# EAGLE schematic CTM_Status_Station_Design_v24 (EAGLE 9.7.0)
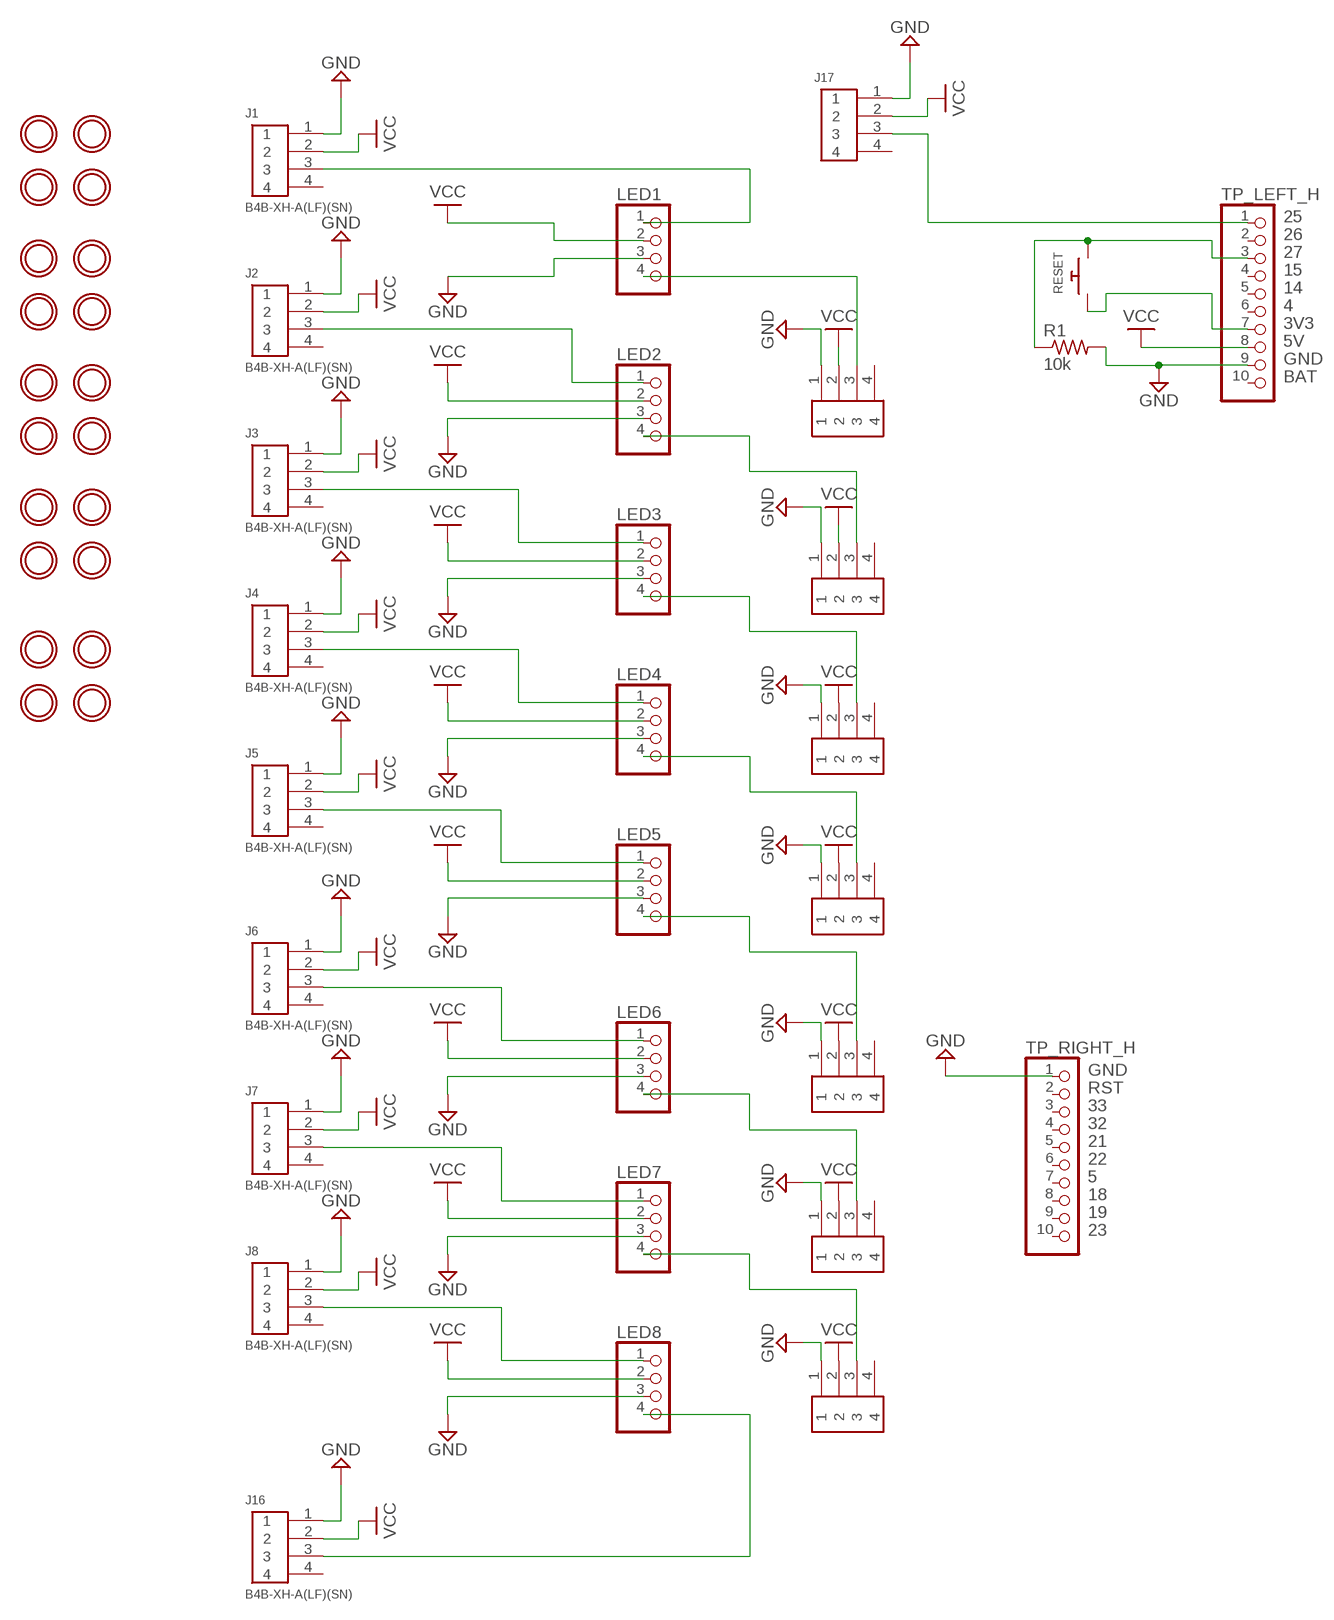
[diagram p0: schematic, sheet 1]

## Parts
J1  B4B-XH-A(LF)(SN)  [B4B-XH-A(LF)(SN)]
J2  B4B-XH-A(LF)(SN)  [B4B-XH-A(LF)(SN)]
J3  B4B-XH-A(LF)(SN)  [B4B-XH-A(LF)(SN)]
J4  B4B-XH-A(LF)(SN)  [B4B-XH-A(LF)(SN)]
J5  B4B-XH-A(LF)(SN)  [B4B-XH-A(LF)(SN)]
J6  B4B-XH-A(LF)(SN)  [B4B-XH-A(LF)(SN)]
J7  B4B-XH-A(LF)(SN)  [B4B-XH-A(LF)(SN)]
J8  B4B-XH-A(LF)(SN)  [B4B-XH-A(LF)(SN)]
J9  B4B-XH-A(LF)(SN)  [B4B-XH-A(LF)(SN)]
J10  B4B-XH-A(LF)(SN)  [B4B-XH-A(LF)(SN)]
J11  B4B-XH-A(LF)(SN)  [B4B-XH-A(LF)(SN)]
J12  B4B-XH-A(LF)(SN)  [B4B-XH-A(LF)(SN)]
J13  B4B-XH-A(LF)(SN)  [B4B-XH-A(LF)(SN)]
J14  B4B-XH-A(LF)(SN)  [B4B-XH-A(LF)(SN)]
J15  B4B-XH-A(LF)(SN)  [B4B-XH-A(LF)(SN)]
J16  B4B-XH-A(LF)(SN)  [B4B-XH-A(LF)(SN)]
J17  B4B-XH-A(LF)(SN)  [B4B-XH-A(LF)(SN)]
LED1  PINHD-1X4  [1X04]
LED2  PINHD-1X4  [1X04]
LED3  PINHD-1X4  [1X04]
LED4  PINHD-1X4  [1X04]
LED5  PINHD-1X4  [1X04]
LED6  PINHD-1X4  [1X04]
LED7  PINHD-1X4  [1X04]
LED8  PINHD-1X4  [1X04]
R1  10k  R-US_0207/7  [0207/7]
RESET  SWITCH_PUSHBUTTONEVQ-PE  [TACT_PANA-EVQ]
TP_LEFT_H  PINHD-1X10  [1X10]
TP_RIGHT_H  PINHD-1X10  [1X10]
U$1  MOUNTINGHOLE2.5  [MOUNTINGHOLE_2.5_PLATED]
U$2  MOUNTINGHOLE2.5  [MOUNTINGHOLE_2.5_PLATED]
U$3  MOUNTINGHOLE2.5  [MOUNTINGHOLE_2.5_PLATED]
U$4  MOUNTINGHOLE2.5  [MOUNTINGHOLE_2.5_PLATED]
U$5  MOUNTINGHOLE2.5  [MOUNTINGHOLE_2.5_PLATED]
U$6  MOUNTINGHOLE2.5  [MOUNTINGHOLE_2.5_PLATED]
U$7  MOUNTINGHOLE2.5  [MOUNTINGHOLE_2.5_PLATED]
U$8  MOUNTINGHOLE2.5  [MOUNTINGHOLE_2.5_PLATED]
U$9  MOUNTINGHOLE2.5  [MOUNTINGHOLE_2.5_PLATED]
U$10  MOUNTINGHOLE2.5  [MOUNTINGHOLE_2.5_PLATED]
U$11  MOUNTINGHOLE2.5  [MOUNTINGHOLE_2.5_PLATED]
U$12  MOUNTINGHOLE2.5  [MOUNTINGHOLE_2.5_PLATED]
U$13  MOUNTINGHOLE2.5  [MOUNTINGHOLE_2.5_PLATED]
U$14  MOUNTINGHOLE2.5  [MOUNTINGHOLE_2.5_PLATED]
U$15  MOUNTINGHOLE2.5  [MOUNTINGHOLE_2.5_PLATED]
U$16  MOUNTINGHOLE2.5  [MOUNTINGHOLE_2.5_PLATED]
U$17  MOUNTINGHOLE2.5  [MOUNTINGHOLE_2.5_PLATED]
U$18  MOUNTINGHOLE2.5  [MOUNTINGHOLE_2.5_PLATED]
U$19  MOUNTINGHOLE2.5  [MOUNTINGHOLE_2.5_PLATED]
U$28  MOUNTINGHOLE2.5  [MOUNTINGHOLE_2.5_PLATED]

## Nets
3V3: RESET.P$1 TP_LEFT_H.7
DIN1: J1.3 LED1.1
DIN2: J2.3 LED2.1
DIN3: J3.3 LED3.1
DIN4: J4.3 LED4.1
DIN5: J5.3 LED5.1
DIN6: J6.3 LED6.1
DIN7: J7.3 LED7.1
DIN8: J8.3 LED8.1
DOUT: J17.3 TP_LEFT_H.1
DOUT1: J10.3 LED1.4
DOUT2: J9.3 LED2.4
DOUT3: J11.3 LED3.4
DOUT4: J12.3 LED4.4
DOUT5: J13.3 LED5.4
DOUT6: J14.3 LED6.4
DOUT7: J15.3 LED7.4
DOUT8: J16.3 LED8.4
GND: J1.1 J2.1 J3.1 J4.1 J5.1 J6.1 J7.1 J8.1 J9.1 J10.1 J11.1 J12.1 J13.1 J14.1 J15.1 J16.1 J17.1 LED1.3 LED2.3 LED3.3 LED4.3 LED5.3 LED6.3 LED7.3 LED8.3 R1.2 TP_LEFT_H.9 TP_RIGHT_H.1
RESET: R1.1 RESET.P$2 TP_LEFT_H.3
VCC: J1.2 J2.2 J3.2 J4.2 J5.2 J6.2 J7.2 J8.2 J9.2 J10.2 J11.2 J12.2 J13.2 J14.2 J15.2 J16.2 J17.2 LED1.2 LED2.2 LED3.2 LED4.2 LED5.2 LED6.2 LED7.2 LED8.2 TP_LEFT_H.8
Unconnected: J1.4 J2.4 J3.4 J4.4 J5.4 J6.4 J7.4 J8.4 J9.4 J10.4 J11.4 J12.4 J13.4 J14.4 J15.4 J16.4 J17.4 TP_LEFT_H.2 TP_LEFT_H.4 TP_LEFT_H.5 TP_LEFT_H.6 TP_LEFT_H.10 TP_RIGHT_H.2 TP_RIGHT_H.3 TP_RIGHT_H.4 TP_RIGHT_H.5 TP_RIGHT_H.6 TP_RIGHT_H.7 TP_RIGHT_H.8 TP_RIGHT_H.9 TP_RIGHT_H.10

## Library data of the parts
J1-J17 = Headers:B4B-XH-A(LF)(SN): CONN HEADER VERT 4POS 2.5MM Manufacturer's datasheet <http://www.jst-mfg.com/product/pdf/eng/eXH.pdf>; CREATED_BY: PCBLayout.com; DIGIKEY_PARTNO: 455-2249-ND; MANUFACTURER: JST Sales America Inc.; MPN: B4B-XH-A(LF)(SN)
LED1-LED8 = Connector:PINHD-1X4: PIN HEADER; CATEGORY: CONNECTOR; SUB-CATEGORY: PIN-HEADER
R1 = adafruit:R-US_: RESISTOR, American symbol
RESET = adafruit:SWITCH_PUSHBUTTON: Buttons SOFTTOUCHSMD_SJ - Soft touch temporary push button (Super Junk Akihabara) Compatible with SKPMANE010 [Mouser: 688-SKPMAN] C&K_KSS = Digikey: KSS221GLFS
TP_LEFT_H = Connector:PINHD-1X10: PIN HEADER; 14: 14; 15: 15; 25: 25; 26: 26; 27: 27; 3V3: 3v3; 4: 4; 5V: 5v; BAT: BAT; CATEGORY: CONNECTOR; GND: GND; SUB-CATEGORY: PIN-HEADER
TP_RIGHT_H = Connector:PINHD-1X10: PIN HEADER; 18: 18; 19: 19; 21: 21; 22: 22; 23: 23; 32: 32; 33: 33; 5: 5; CATEGORY: CONNECTOR; GND: GND; RST: RST; SUB-CATEGORY: PIN-HEADER
U$1-U$19 U$28 = microbuilder:MOUNTINGHOLE: Mounting Hole For #2 screws (0.086"/2.18mm width, 0.094"/2.4mm hole) use 2.5mm; BOM: EXCLUDE; REV: A